# EAGLE design ProDuino (EAGLE 6.5.0)
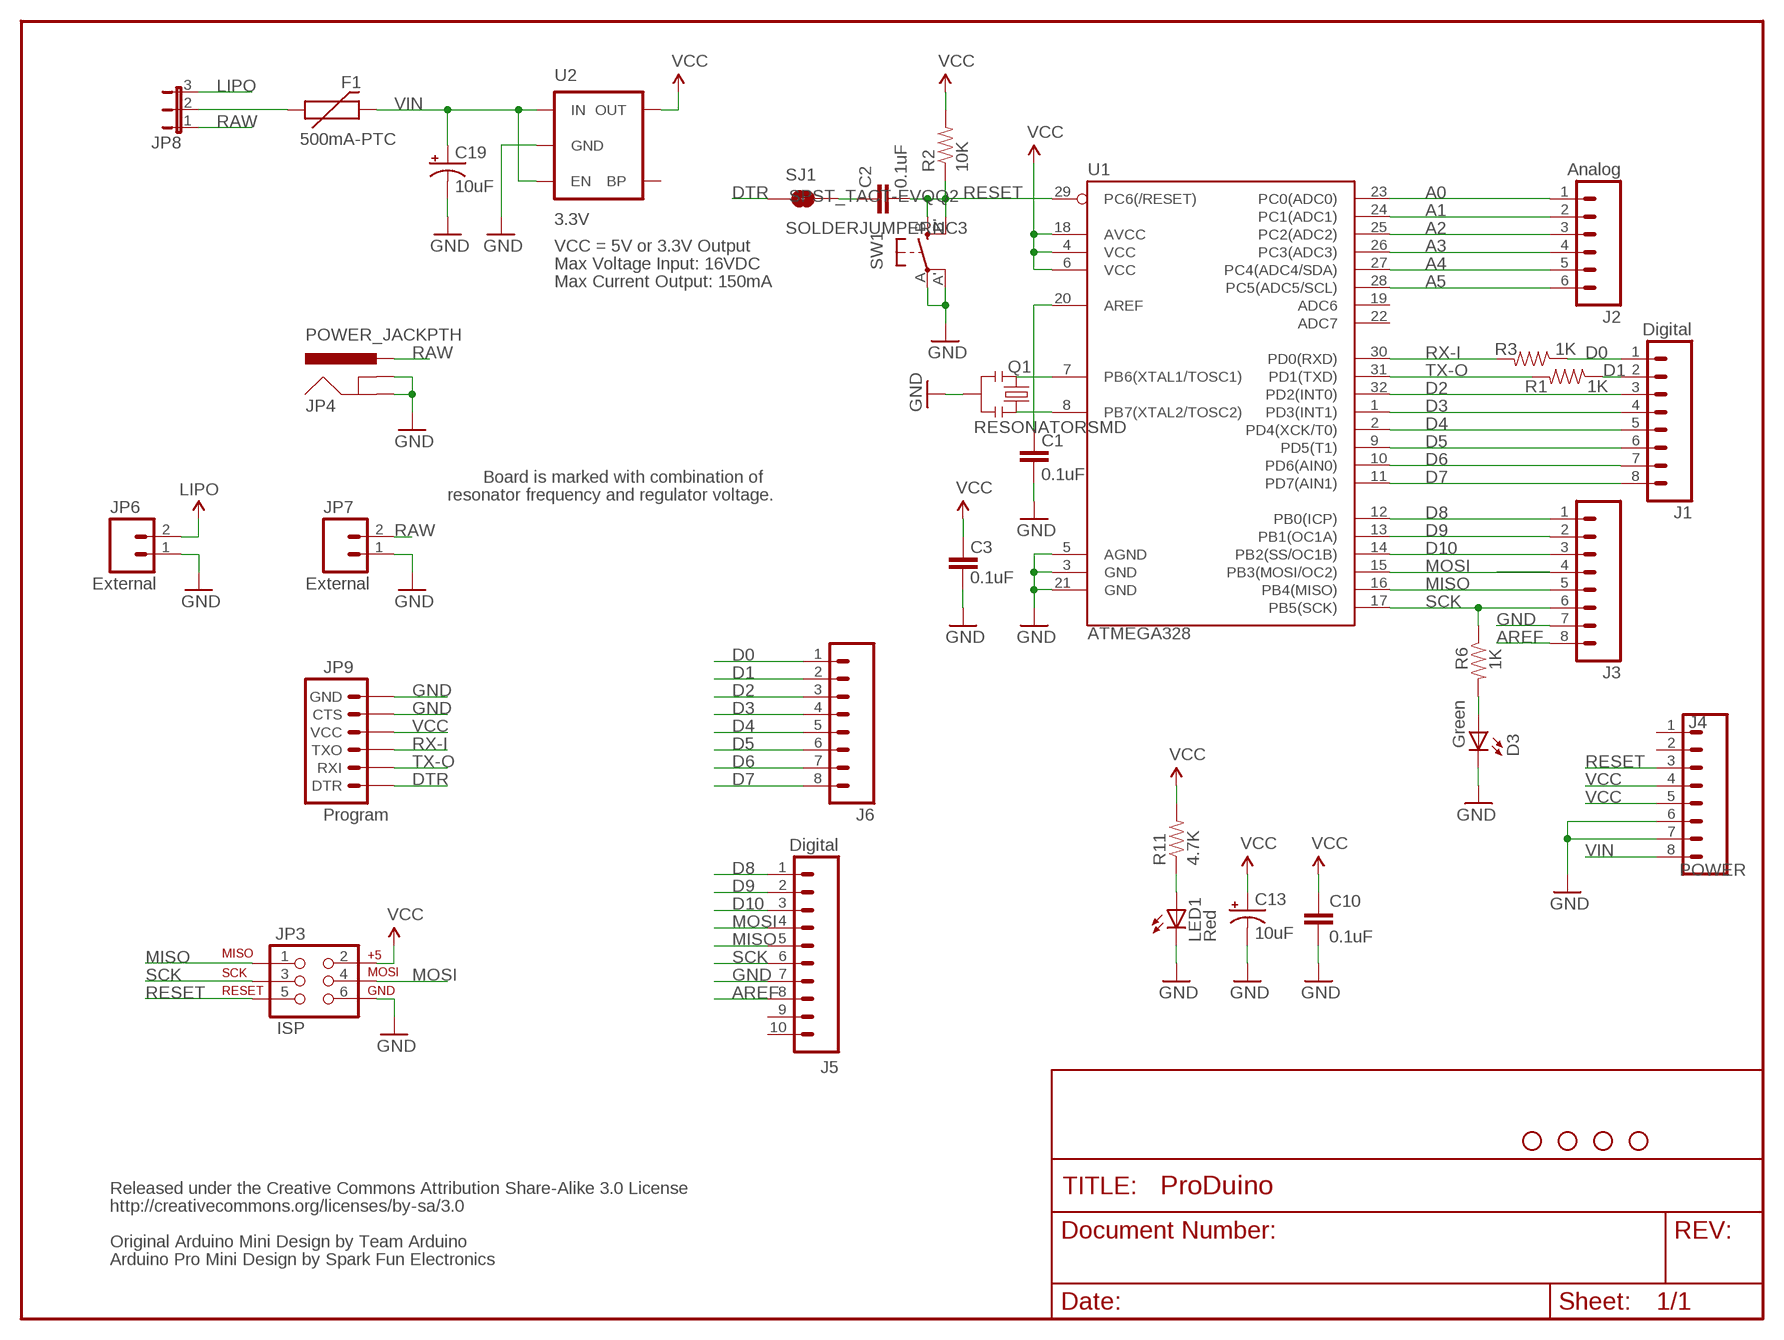
[diagram p0: schematic, sheet 1]

## Parts
C1  0.1uF  CAP0603-CAP  [0603-CAP]
C2  0.1uF  CAP0603-CAP  [0603-CAP]
C3  0.1uF  CAP0603-CAP  [0603-CAP]
C10  0.1uF  CAP0603-CAP  [0603-CAP]
C13  10uF  CAP_POL1206  [EIA3216]
C19  10uF  CAP_POL1206  [EIA3216]
D3  Green  LED0603  [LED-0603]
F1  500mA-PTC  PTCSMD  [PTC-1206]
J1  Digital  M081X08  [1X08]
J2  Analog  M06SIP  [1X06]
J3  M081X08  [1X08]
J4  POWER  M081X08  [1X08]
J5  Digital  M10"  [1X10]
J6  M081X08  [1X08]
JP3  ISP  AVR_SPI_PRG_6PTH  [2X3]
JP4  POWER_JACKPTH  [POWER_JACK_PTH]
JP6  External  M02PTH  [1X02]
JP7  External  M02PTH  [1X02]
JP8  JP2E  [JP2]
JP9  Program  ARDUINO_SERIAL_PROGRAMPTH  [1X06]
LED1  Red  LED0603  [LED-0603]
Q1  RESONATORSMD  [RESONATOR-SMD]
R1  1K  RESISTOR0603-RES  [0603-RES]
R2  10K  RESISTOR0603-RES  [0603-RES]
R3  1K  RESISTOR0603-RES  [0603-RES]
R6  1K  RESISTOR0603-RES  [0603-RES]
R11  4.7K  RESISTOR0603-RES  [0603-RES]
SJ1  SOLDERJUMPERNC3  SOLDERJUMPERNC2  [SJ_2S-NOTRACE]
SW1  SPST_TACT-EVQQ2  [EVQ-Q2]
U1  ATMEGA328  ATMEGA168  [TQFP32-08]
U2  3.3V  V_REG_LDOSMD  [SOT23-5]
U$1  STAND-OFF  [STAND-OFF]
U$3  STAND-OFF  [STAND-OFF]
U$9  STAND-OFF  [STAND-OFF]
U$10  STAND-OFF  [STAND-OFF]

## Nets
A0: J2.1 U1.23(PC0(ADC0))
A1: J2.2 U1.24(PC1(ADC1))
A2: J2.3 U1.25(PC2(ADC2))
A3: J2.4 U1.26(PC3(ADC3))
A4: J2.5 U1.27(PC4(ADC4/SDA))
A5: J2.6 U1.28(PC5(ADC5/SCL))
AREF: C1.2 J3.8 J5.8 U1.20(AREF)
D0: J1.1 J6.1 R3.1
D1: J1.2 J6.2 R1.1
D2: J1.3 J6.3 U1.32(PD2(INT0))
D3: J1.4 J6.4 U1.1(PD3(INT1))
D4: J1.5 J6.5 U1.2(PD4(XCK/T0))
D5: J1.6 J6.6 U1.9(PD5(T1))
D6: J1.7 J6.7 U1.10(PD6(AIN0))
D7: J1.8 J6.8 U1.11(PD7(AIN1))
D8: J3.1 J5.1 U1.12(PB0(ICP))
D9: J3.2 J5.2 U1.13(PB1(OC1A))
D10: J3.3 J5.3 U1.14(PB2(SS/OC1B))
DTR: JP9.1(DTR) SJ1.1
GND [vcc]: C1.1 C3.1 C10.2 C13.C(-) C19.C(-) D3.C J3.7 J4.6 J4.7 J5.7 JP3.6 JP4.GND JP4.GNDBREAK JP6.1 JP7.1 JP9.5(CTS) JP9.6(GND) LED1.C Q1.2 SW1.A'(P1) SW1.A(P) U1.3(GND) U1.5(AGND) U1.21(GND) U2.2(GND)
LIPO: JP6.2 JP8.3
MISO: J3.5 J5.5 JP3.1 U1.16(PB4(MISO))
MOSI: J3.4 J5.4 JP3.4 U1.15(PB3(MOSI/OC2))
N$1: C2.1 SJ1.2
N$3: Q1.1 U1.8(PB7(XTAL2/TOSC2))
N$4: Q1.3 U1.7(PB6(XTAL1/TOSC1))
N$7: D3.A R6.2
N$25: F1.1 JP8.2
N$38: LED1.A R11.1
RAW [vcc]: JP4.PWR JP7.2 JP8.1
RESET: C2.2 J4.3 JP3.5 R2.1 SW1.B'(S1) SW1.B(S) U1.29(PC6(/RESET))
RX-I: JP9.3(TXO) R3.2 U1.30(PD0(RXD))
SCK: J3.6 J5.6 JP3.3 R6.1 U1.17(PB5(SCK))
TX-O: JP9.2(RXI) R1.2 U1.31(PD1(TXD))
VCC: C3.2 C10.1 C13.A(+) J4.4 J4.5 JP3.2 JP9.4(VCC) R2.2 R11.2 U1.4(VCC) U1.6(VCC) U1.18(AVCC) U2.5(OUT)
VIN [vcc]: C19.A(+) F1.2 J4.8 U2.1(IN) U2.3(EN)
Unconnected: J4.1 J4.2 J5.9 J5.10 U1.19(ADC6) U1.22(ADC7) U2.4(BP)

## Notes on the sheet
- VCC = 5V or 3.3V Output
- Max Voltage Input: 16VDC
- Max Current Output: 150mA
- Board is marked with combination of
- resonator frequency and regulator voltage.
- Released under the Creative Commons Attribution Share-Alike 3.0 License
- http://creativecommons.org/licenses/by-sa/3.0
- Original Arduino Mini Design by Team Arduino
- Arduino Pro Mini Design by Spark Fun Electronics

## Library data of the parts
C1-C3 C10 = SparkFun-Capacitors:CAP: Capacitor Standard 0603 ceramic capacitor, and 0.1" leaded capacitor.
C13 C19 = SparkFun:CAP_POL: Capacitor Polarized These are standard SMD and PTH capacitors. Normally 10uF, 47uF, and 100uF in electrolytic and tantalum varieties. Always verify the external diameter of the through hole cap, it varies with capacity, voltage, and manufacturer. The EIA devices should be standard.
D3 LED1 = SparkFun:LED: LEDs Standard schematic elements and footprints for 5mm, 3mm, 1206, and 0603 sized LEDs. 5mm - Spark Fun Electronics SKU : COM-00529 (and others)
F1 = SparkFun:PTC: Resettable Fuse PTC Resettable Fuse. Spark Fun Electronics SKU : COM-08357
J1 J3 J6 = SparkFun:M08: Header 8 Standard 8-pin 0.1" header. Use with straight break away headers (SKU : PRT-00116), right angle break away headers (PRT-00553), swiss pins (PRT-00743), machine pins (PRT-00117), and female headers (PRT-00115).
J2 = SparkFun:M06: Header 6 Standard 6-pin 0.1" header. Use with straight break away headers (SKU : PRT-00116), right angle break away headers (PRT-00553), swiss pins (PRT-00743), machine pins (PRT-00117), and female headers (PRT-00115). Molex polarized connector foot print use with SKU : PRT-08094 with associated crimp pins and housings. NOTES ON THE VARIANTS LOCK and LOCK_LONGPADS... This footprint was designed to help hold the alignment of a through-hole component (i.e. 6-pin header) while soldering it into place. You may notice that each hole has been shifted either up or down by 0.005 of an inch from it's more standard position (which is a perfectly straight line). This slight alteration caused the pins (the squares in the middle) to touch the edges of the holes. Because they are alternating, it causes a "brace" to hold the component in place. 0.005 has proven to be the perfect amount of "off-center" position when using our standard breakaway headers. Although looks a little odd when you look at the bare footprint, once you have a header in there, the alteration is very hard to notice. Also, if you push a header all the way into place, it is covered up entirely on the bottom side. This idea of altering the position of holes to aid alignment will be further integrated into the Sparkfun Library for other footprints. It can help hold any component with 3 or more connection pins.
J4 = SparkFun-Connectors:M08: Header 8 Standard 8-pin 0.1" header. Use with straight break away headers (SKU : PRT-00116), right angle break away headers (PRT-00553), swiss pins (PRT-00743), machine pins (PRT-00117), and female headers (PRT-00115).
J5 = SparkFun-Connectors:M10: Header 10 Standard 10-pin 0.1" header. Use with straight break away headers (SKU : PRT-00116), right angle break away headers (PRT-00553), swiss pins (PRT-00743), machine pins (PRT-00117), and female headers (PRT-00115).
JP3 = SparkFun:AVR_SPI_PRG_6: AVR ISP 6 Pin This is the reduced ISP connector for AVR programming. Common on Arduino. This footprint will take up less PCB space and can be used with a 10-pin to 6-pin adapter such as SKU: BOB-08508
JP4 = SparkFun:POWER_JACK: Power Jack This is the standard 5.5mm barrel jack for power. The PTH is the most common, proven, reliable, footprint. All others are experimental. The Slot footprint only works if the mill layer is transmitted to the PCB fab house so be warned. Spark Fun Electronics SKU : PRT-00119. Mating wall wart : TOL-00298 (and others)
JP6 JP7 = SparkFun:M02: Header 2 Standard 2-pin 0.1" header. Use with straight break away headers (SKU : PRT-00116), right angle break away headers (PRT-00553), swiss pins (PRT-00743), machine pins (PRT-00117), and female headers (PRT-00115). Molex polarized connector foot print use with SKU : PRT-08233 with associated crimp pins and housings.
JP8 = jumper:JP2E: JUMPER
JP9 = SparkFun:ARDUINO_SERIAL_PROGRAM
Q1 = SparkFun:RESONATOR: Resonator Small SMD resonator. This is the itty bitty 10/20MHz resonators with built in caps. CSTCE10M0G55 and CSTCE20M0V53. Footprint has been reviewed closely but hasn't been tested yet.
R1-R3 R6 R11 = SparkFun-Resistors:RESISTOR: Resistor Basic schematic elements and footprints for 0603, 1206, and PTH resistors.
SJ1 = SparkFun-Passives:SOLDERJUMPER: Solder Jumper Standard SMD solder jumper. Used to automate production. Two varients : Normally Open and Normally Closed are the same, but have different paste layers. NC will have a large amount of paste and should jumper during reflow.
SW1 = adafruit:SPST_TACT: SMT 6mm switch, EVQQ2 series http://www.ladyada.net/library/eagle
U1 = SparkFun:ATMEGA168
U2 = SparkFun:V_REG_LDO: Voltage Regulator LDO Standard 150mA LDO voltage regulator in SOT-23 layout. Micrel part MIC5205. BP (by-pass) pin is used to lower output noise with 470pF cap.
U$1 U$3 U$9 U$10 = SparkFun:STAND-OFF: Stand Off This is the mechanical footprint for a #4 phillips button head screw. Use the keepout ring to avoid running the screw head into surrounding components. SKU : PRT-00447

## Net classes
0 default: width 0.203 mm
1 vcc: width 0.254 mm

## Board
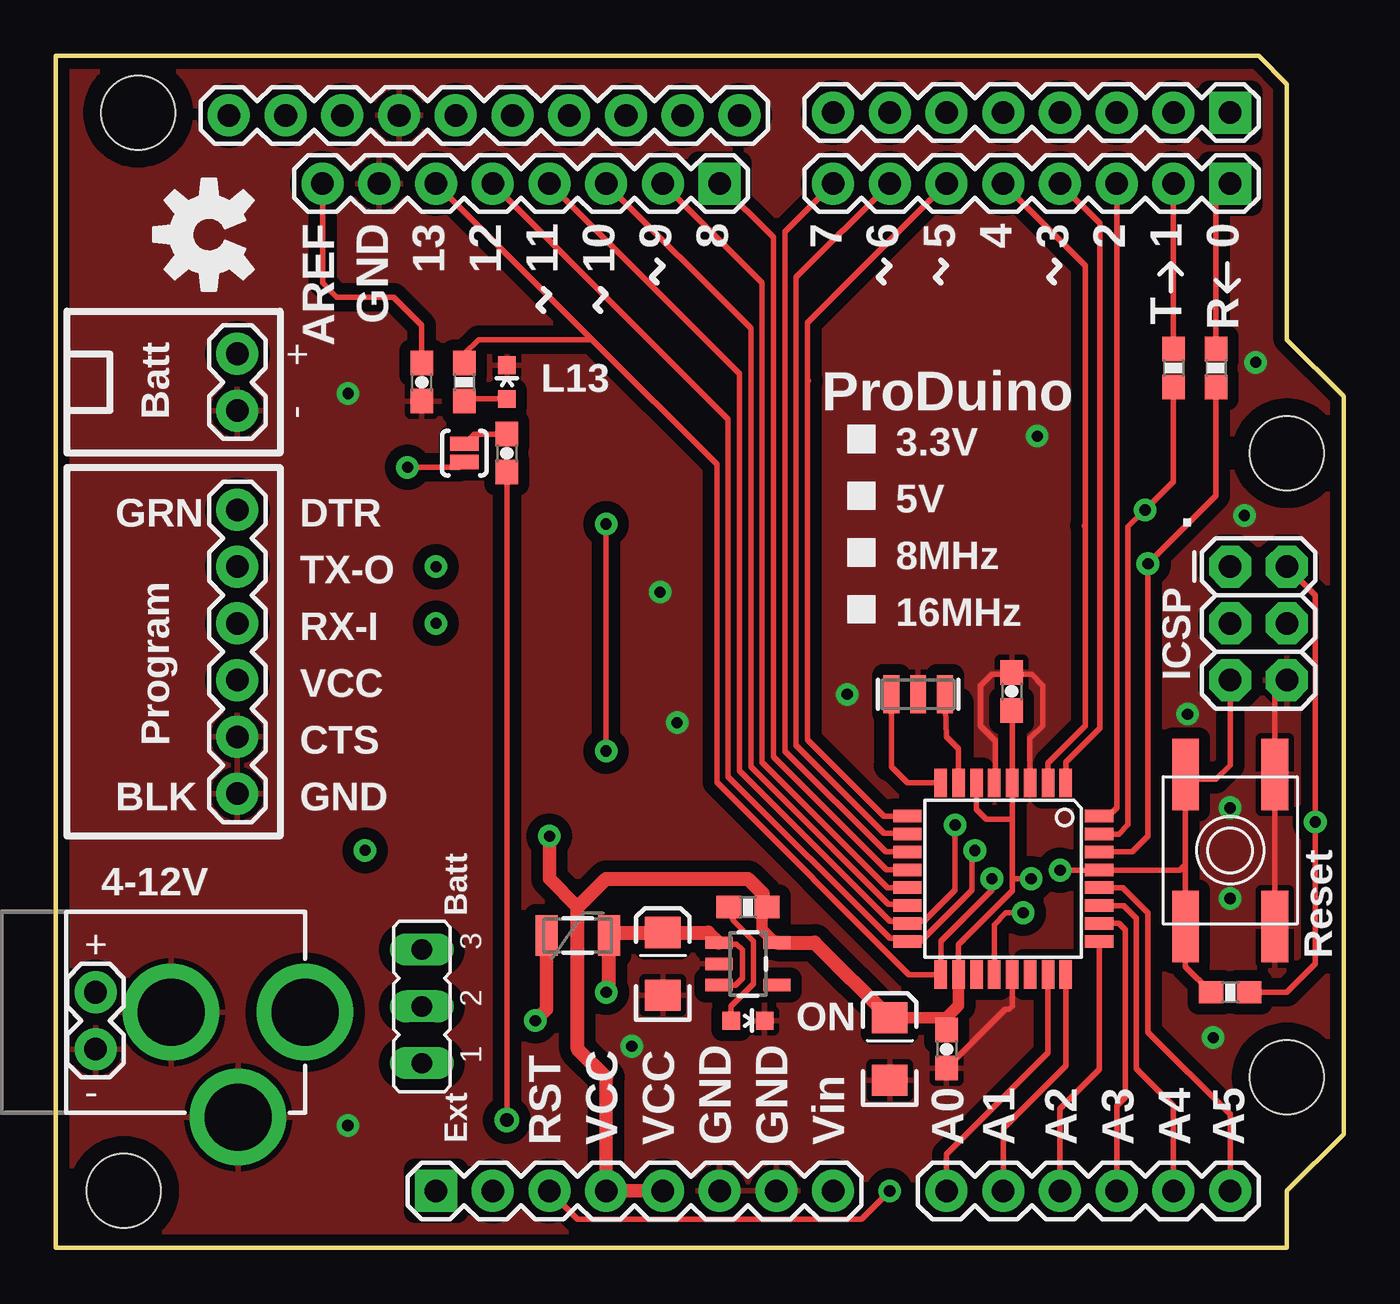
[diagram p1: board, top side]
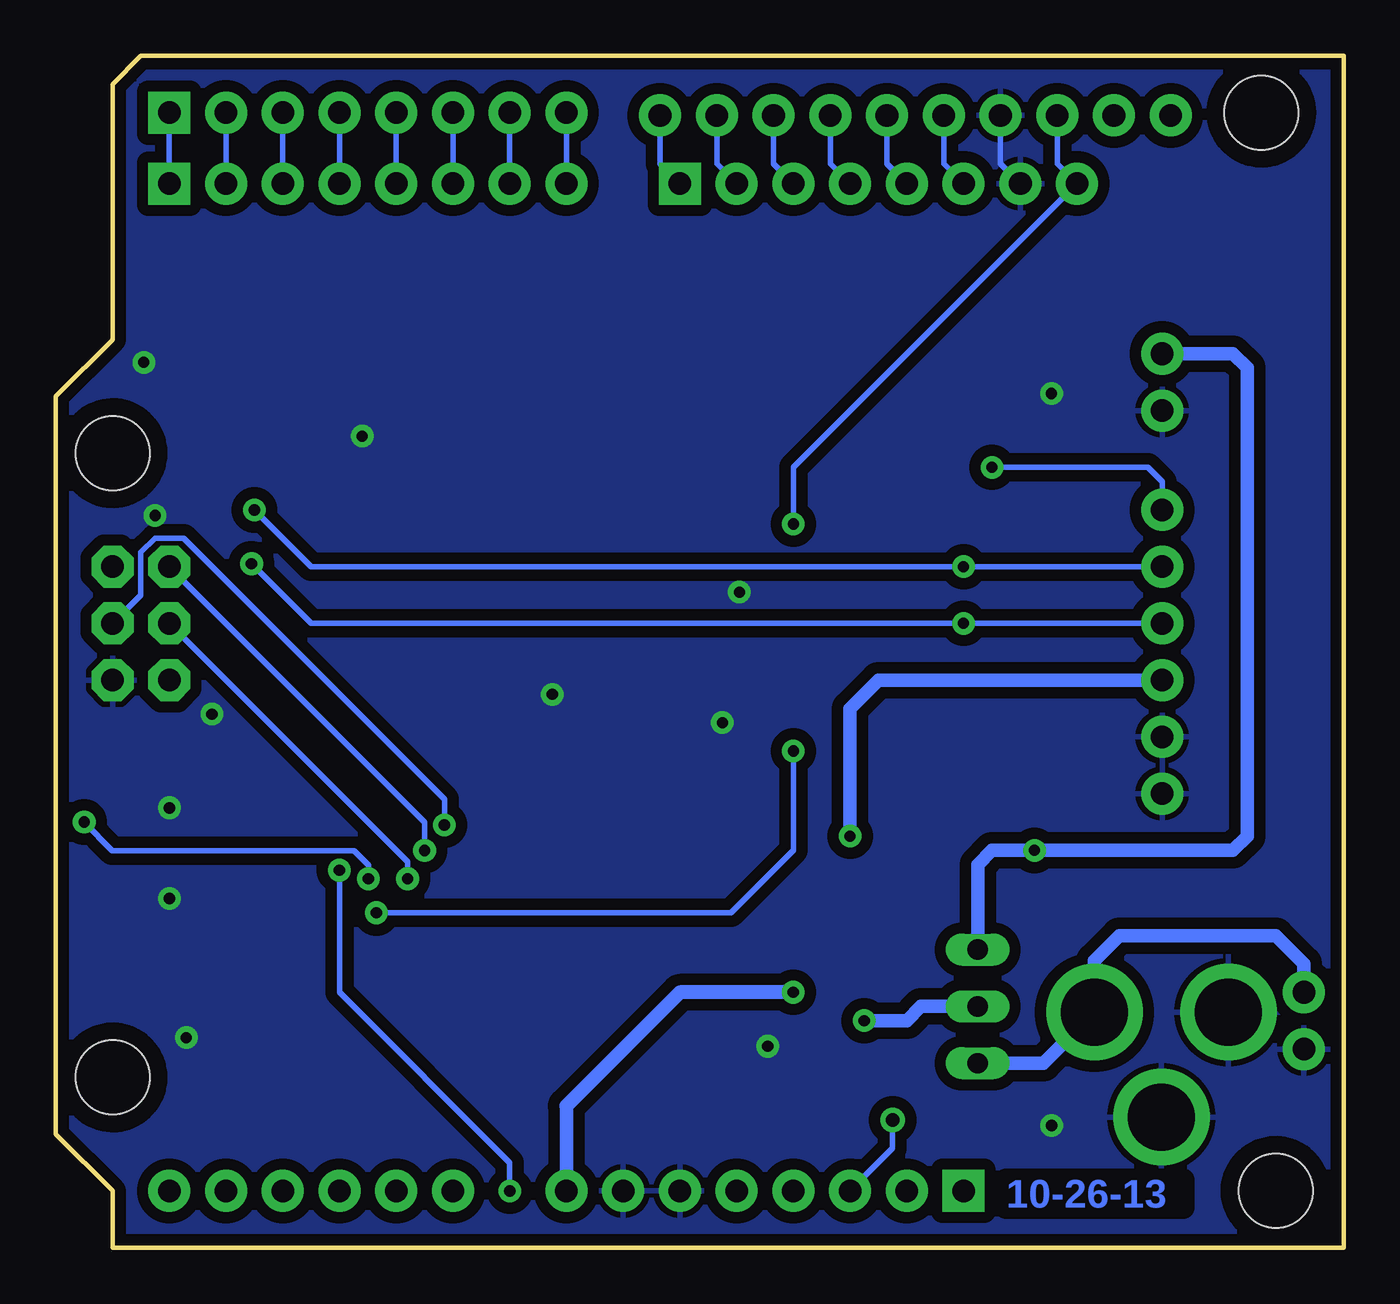
[diagram p2: board, bottom side, seen from below]

Size 57.66 x 53.34 mm. Coordinates in mm from the lower left corner, seen from the top.
Outline: 0,53.34 0,0 55.12,0 55.12,2.54 57.66,5.08 57.66,38.1 55.12,40.64 55.12,52.07 53.85,53.34 0,53.34
Copper layers (1*16): Top 0.035mm / dielectric 1.5mm / Bottom 0.035mm
Design rules "SparkFun *": minimum track width 8mil, minimum drill 0.3mm, track to track 8mil, track to pad 8mil, pad to pad 8mil, via to via 8mil, smd to smd 8mil, copper to edge 10mil, drill to drill 8mil, minimum pad ring 10mil, minimum via ring 10mil, stop-mask expansion 4mil, vias tented up to drill 20mil, thermal gap 10mil
tRestrict: area 37.3,21.6 to 40.4,24.4

### Footprints (pad centres in the part's own frame; a part is rotated, then mirrored left to right if it is on the bottom)
0603-CAP = smd 1.1 x 1: 1 -0.85,0; 2 0.85,0
EIA3216 = smd 1.4 x 1.6: A 1.4,0; C -1.4,0
LED-0603 = smd 0.8 x 0.8: A 0,-0.75; C 0,0.75
PTC-1206 = smd 1 x 1.8: 1 -1.4,0; 2 1.4,0
1X08 = drill 1.016 pad 1.88 square: 1 0,0 | drill 1.016 pad 1.88: 2 2.54,0; 3 5.08,0; 4 7.62,0; 5 10.16,0; 6 12.7,0; 7 15.24,0; 8 17.78,0
1X06 = drill 1.016 pad 1.88: 1 0,0; 2 2.54,0; 3 5.08,0; 4 7.62,0; 5 10.16,0; 6 12.7,0
1X10 = drill 1.016 pad 1.88: 1 0,0; 2 2.54,0; 3 5.08,0; 4 7.62,0; 5 10.16,0; 6 12.7,0; 7 15.24,0; 8 17.78,0; 9 20.32,0; 10 22.86,0
2X3 = drill 1.016 pad 1.88 octagon: 1 0,0; 2 0,2.54; 3 2.54,0; 4 2.54,2.54; 5 5.08,0; 6 5.08,2.54
POWER_JACK_PTH = drill 2.997 pad 4.318: GND 0,7.7; GNDBREAK 4.7,10.7; PWR 0,13.7
1X02 = drill 1.016 pad 1.88: 1 0,0; 2 2.54,0
JP2 = drill 0.914 long: 1 -2.54,0; 2 0,0; 3 2.54,0
RESONATOR-SMD = smd 0.7 x 1.7: 1 -1.2,0; 2 0,0; 3 1.2,0
0603-RES = smd 1.1 x 1: 1 -0.85,0; 2 0.85,0
SJ_2S-NOTRACE = smd 0.635 x 1.27: 1 -0.401,0; 2 0.413,0
EVQ-Q2 = smd 3.2 x 1.2: A -3.4,-2; A' 3.4,-2; B -3.4,2; B' 3.4,2
TQFP32-08 = smd 1.27 x 0.559: 1 -4.293,2.8; 2 -4.293,2; 3 -4.293,1.2; 4 -4.293,0.4; 5 -4.293,-0.4; 6 -4.293,-1.2; 7 -4.293,-2; 8 -4.293,-2.8; 17 4.293,-2.8; 18 4.293,-2; 19 4.293,-1.2; 20 4.293,-0.4; 21 4.293,0.4; 22 4.293,1.2; 23 4.293,2; 24 4.293,2.8 | smd 0.559 x 1.27: 9 -2.8,-4.293; 10 -2,-4.293; 11 -1.2,-4.293; 12 -0.4,-4.293; 13 0.4,-4.293; 14 1.2,-4.293; 15 2,-4.293; 16 2.8,-4.293; 25 2.8,4.293; 26 2,4.293; 27 1.2,4.293; 28 0.4,4.293; 29 -0.4,4.293; 30 -1.2,4.293; 31 -2,4.293; 32 -2.8,4.293
SOT23-5 = smd 0.55 x 1.2: 1 -0.95,-1.3; 2 0,-1.3; 3 0.95,-1.3; 4 0.95,1.3; 5 -0.95,1.3
STAND-OFF = hole 3.302: 0,0

### Placement (x,y rotation side)
C1  16.38,38.73 90 top
C2  20.19,35.56 270 top
C3  42.8,24.89 270 top
C10  39.88,8.89 270 top
C13  37.34,8.89 90 top
C19  27.18,12.7 90 top
D3  20.19,38.73 0 top
F1  23.37,13.97 0 top
J1  52.58,47.62 180 top
J2  39.88,2.54 0 top
J3  29.72,47.62 180 top
J4  17.02,2.54 0 top
J5  30.61,50.67 180 top
J6  52.58,50.8 180 top
JP3  52.58,30.48 270 top
JP4  -2.54,10.54 270 top
JP6  8.13,37.47 90 top
JP7  1.78,8.89 90 top
JP8  16.38,10.79 90 top
JP9  8.13,33.02 270 top
LED1  30.99,10.16 270 top
Q1  38.61,24.77 0 top
R1  50.04,39.37 270 top
R2  52.58,11.43 0 top
R3  51.94,39.37 270 top
R6  18.29,38.73 270 top
R11  30.99,15.24 0 top
SJ1  18.29,35.56 90 top
SW1  52.58,17.78 90 top
U1  42.42,16.51 270 top
U2  30.99,12.7 270 top
U$1  3.68,50.8 0 top
U$2  [OSHW-LOGO-M]  6.86,45.34 90 top
U$3  3.05,2.54 0 top
U$9  55.12,35.56 0 top
U$10  55.12,7.62 0 top

### Tracks (layer width: path | path; a pad name or v marks a point on that pad's centre or on a via)
A0
  Top 0.254: U1.23 44.42,8.73 39.88,4.19 J2.1
A1
  Top 0.254: U1.24 45.22,8.13 42.42,5.33 J2.2
A2
  Top 0.254: U1.25 46.71,7.98 44.96,6.22 44.96,2.79 45.09,2.67 J2.3
A3
  Top 0.254: U1.26 47.59,14.51 47.88,14.22 47.88,6.73 47.5,6.35 J2.4
A4
  Top 0.254: U1.27 47.81,15.31 48.39,14.73 48.39,8 50.04,6.35 J2.5
A5
  Top 0.254: U1.28 47.77,16.11 48.9,14.99 48.9,9.65 52.58,5.97 J2.6
AREF  (via drill 0.5, 0.51)
  Top 0.254: U1.20 42.02,14.46 42.55,14.99 v43.31,14.99 | v24.64,22.23 v24.64,32.38 | J3.8 11.94,43.18 12.57,42.55 15.11,42.55 16.38,41.27 C1.2
  Bottom 0.254: v43.31,14.99 27.43,14.99 24.64,17.78 v24.64,22.23 | v24.64,32.38 24.64,34.92 J3.8 12.83,48.51 J5.8
D0
  Top 0.254: R3.1 51.94,46.99 J1.1
  Bottom 0.254: J6.1 J1.1
D1
  Top 0.254: R1.1 J1.2
  Bottom 0.254: J6.2 J1.2
D2
  Top 0.254: U1.32 47.11,19.31 47.12,19.3 47.5,19.68 J1.3
  Bottom 0.254: J6.3 J1.3
D3
  Top 0.254: U1.1 45.22,21.72 46.74,23.24 46.74,45.85 J1.4
  Bottom 0.254: J6.4 J1.4
D4
  Top 0.254: U1.2 44.42,21.68 46.1,23.37 46.1,32.26 | 46.1,32.26 46.1,43.94 J1.5 | 46.1,32.26 46.05,32.31
  Bottom 0.254: J6.5 J1.5
D5
  Top 0.254: U1.9 38.23,19.3 | U1.9 | U1.9 37.08,19.3 33.66,22.73 33.66,38.86 | 33.66,38.86 33.66,41.4 J1.6 | 33.66,38.86 33.71,38.81
  Bottom 0.254: J6.6 J1.6
D6
  Top 0.254: U1.10 38.01,18.51 37.97,18.54 37.08,18.54 33.15,22.48 33.15,43.43 J1.7
  Bottom 0.254: J6.7 J1.7
D7
  Top 0.254: U1.11 37.15,17.71 32.64,22.23 32.64,45.47 J1.8
  Bottom 0.254: J6.8 J1.8
D8
  Top 0.254: U1.12 37.19,16.91 32.13,21.97 32.13,45.21 J3.1
  Bottom 0.254: J5.1 30.61,48.51 J3.1
D9
  Top 0.254: U1.13 37.23,16.11 31.62,21.72 31.62,43.18 J3.2
  Bottom 0.254: J5.2 28.07,48.51 J3.2
D10
  Top 0.254: U1.14 38.1,15.34 38.1,15.37 37.28,15.37 31.11,21.53 31.11,41.15 J3.3
  Bottom 0.254: J5.3 25.53,48.51 J3.3
DTR  (via drill 0.5)
  Top 0.254: v15.75,34.92 18.05,34.92 SJ1.1
  Bottom 0.254: JP9.1 8.13,34.29 8.76,34.92 v15.75,34.92
GND  (via drill 0.5, 0.51)
  Top 0.254: SW1.A SW1.A' 54.58,24.86 JP3.6 | U1.5 42.08,20.8 42.08,22.69 41.4,23.37 41.4,25.15 41.91,25.65 42.71,25.65 C3.1 42.89,25.65 43.69,25.65 44.2,25.15 44.2,23.37 43.62,22.79 U1.3 | U1.21 42.82,10.81 42.67,10.67 42.51,10.67 C10.2
  Bottom 0.254: J5.7 15.37,48.51 J3.7
  other vias: 35.43,24.77 27.81,23.5 52.58,15.62 50.67,23.88 43.94,36.32 51.82,9.4 52.58,19.68 27.05,29.34 13.08,5.46 25.78,9.02 13.08,38.23 53.72,39.62 53.21,32.77
  pour Top (isolate 0.508): -0.51,53.85 58.67,53.85 58.67,-1.02 -0.51,-1.02
  pour Bottom (isolate 0.508): -1.02,54.36 59.18,54.36 59.18,-1.02 -1.02,-1.02
LIPO  (via drill 0.5)
  Bottom 0.61: JP6.2 4.95,40.01 4.32,39.37 4.32,18.41 4.95,17.78 v13.84,17.78 15.75,17.78 16.38,17.14 JP8.3
MISO  (via drill 0.51)
  Top 0.254: U1.16 | U1.16 38.22,13.71 38.23,13.72 38.73,13.72 41.02,16 41.02,17.65 v41.15,17.78 | U1.16 38.12,13.74 38.23,13.84 37.34,13.84 30.1,21.08 30.1,37.08 J3.5
  Bottom 0.254: JP3.1 41.15,19.05 v41.15,17.78 | J5.5 20.45,48.51 J3.5
MOSI  (via drill 0.51)
  Top 0.254: 38.23,14.48 38.16,14.48 U1.15 | v40.26,18.92 40.26,16 38.86,14.61 38.35,14.61 38.23,14.48 | 38.23,14.48 38.2,14.51 U1.15 | U1.15 38.12,14.58 38.1,14.61 37.34,14.61 30.61,21.34 30.61,39.12 J3.4
  Bottom 0.254: JP3.4 53.85,29.21 53.85,31.11 53.21,31.75 51.94,31.75 40.26,20.07 v40.26,18.92 | J5.4 22.99,48.51 J3.4
N$1
  Top 0.254: C2.1 18.72,36.41 SJ1.2
N$3
  Top 0.254: U1.8 38.12,20.8 37.41,21.52 Q1.1
N$4
  Top 0.254: Q1.3 39.88,22.86 40.42,22.32 U1.7
N$7
  Top 0.254: D3.A 18.39,37.98 R6.2
N$25  (via drill 0.5)
  Top 0.61: F1.1 21.97,10.66 v21.46,10.16
  Top 0.635: F1.1 22.1,13.97
  Bottom 0.61: JP8.2 18.92,10.79 19.56,10.16 v21.46,10.16
N$38
  Top 0.254: R11.1 30.34,14.62 31.24,13.72 31.24,11.81 30.23,10.79 30.23,10.16 LED1.A
RAW
  Bottom 0.61: JP7.2 1.78,12.7 3.05,13.97 10.03,13.97 11.16,12.84 JP4.PWR 13.45,8.26 JP8.1
RESET  (via drill 0.51, 0.6)
  Top 0.254: v37.34,2.54 36.07,1.27 23.37,1.27 J4.3 | v44.96,16.89 46.61,16.89 46.63,16.91 U1.29 46.84,16.91 46.86,16.89 50.32,16.89 50.58,17.14 | C2.2 20.2,34.9 20.2,5.73 v20.19,5.71 | 50.58,17.14 SW1.B' 50.8,20.95 51.94,20.95 52.58,21.59 JP3.5 | 50.58,17.14 SW1.B 50.58,12.58 R2.1
  Bottom 0.254: v44.96,16.89 44.96,11.43 37.34,3.81 v37.34,2.54 | v20.19,5.71 20.19,4.45 J4.3
RX-I  (via drill 0.5, 0.51)
  Top 0.254: U1.30 48.19,17.71 48.9,18.41 v48.9,30.61 51.94,33.66 R3.2
  Bottom 0.254: v48.9,30.61 46.23,27.94 v17.02,27.94 JP9.3
SCK  (via drill 0.51)
  Top 0.254: v41.91,16.51 41.91,16 39.62,13.71 U1.17 38.2,12.22 29.59,20.83 29.59,35.05 24,40.64 | J3.6 24,40.64 | 24,40.64 18.92,40.64 18.29,40.01 R6.1 18.29,39.37
  Bottom 0.254: v41.91,16.51 41.91,17.27 JP3.3 | J5.6 17.91,48.51 J3.6
TX-O  (via drill 0.5, 0.51)
  Top 0.254: U1.31 47.59,18.51 48.01,18.92 48.01,32.26 v48.77,33.02 50.04,34.29 R1.2
  Bottom 0.254: v48.77,33.02 46.23,30.48 v17.02,30.48 JP9.2
VCC  (via drill 0.5, 0.51)
  Top 0.254: 39.88,10.29 C10.1 | C13.A 37.34,10.16 | 32.13,13.59 32.19,13.65 32.2,13.65 U2.5 | U1.18 40.41,13.56 42.82,15.98 42.82,16.51 | U1.4 | 42.82,16.51 42.82,19.18 | 42.82,19.18 U1.4 | JP3.2 56.39,29.21 v56.39,19.05 56.39,12.7 55.12,11.43 R2.2 | 42.82,16.51 v43.66,16.51 | U1.6 41.22,19.61 41.66,19.18 42.82,19.18 | U1.4 42.82,24.02 C3.2
  Top 0.508: U1.18 40.42,10.83 39.88,10.29 37.47,10.29 | 31.64,15.86 R11.2 31.62,15.24 31.62,14.22 32.2,13.65
  Top 0.61: 23.37,15.24 22.1,16.51 v22.1,18.41 | 24.64,7.62 J4.4 J4.5
  Top 0.635: U2.5 33.98,13.65 C13.A 37.46,10.29 37.47,10.29 | 31.64,15.86 30.99,16.51 24.64,16.51 23.37,15.24 23.37,8.89 24.64,7.62
  Bottom 0.254: v43.66,16.51 43.66,17.12 44.3,17.75 55.14,17.75 v56.39,19.05
  Bottom 0.61: v22.1,18.41 22.1,24.13 20.83,25.4 JP9.4
VIN  (via drill 0.51)
  Top 0.254: U2.3 30.42,11.75 30.73,12.06 30.73,13.34 30.48,13.59 29.72,13.59 29.69,13.62 U2.1
  Top 0.635: U2.1 29.66,13.65 29.21,14.1 C19.A 24.77,14.1 24.64,13.97 F1.2 24.77,11.56 v24.64,11.43
  Bottom 0.61: 34.8,6.35 J4.8
  Bottom 0.635: 34.8,6.35 29.72,11.43 v24.64,11.43

### Text on the board
Bottom: 10-26-13
tPlace: AREF | GND | 13 | 12 | 11 | 10 | 9 | 8 | 7 | 6 | 5 | 4 | 3 | 2 | 1 | 0 | T | R | + | L13 | Batt | - | ProDuino | 3.3V | 5V | GRN | DTR | . | TX-O | 8MHz | 16MHz | RX-I | VCC | ICSP | Program | CTS | BLK | GND | 4-12V | Batt | + | Reset | ON | - | Ext | RST | VCC | VCC | GND | GND | Vin | A0 | A1 | A2 | A3 | A4 | A5